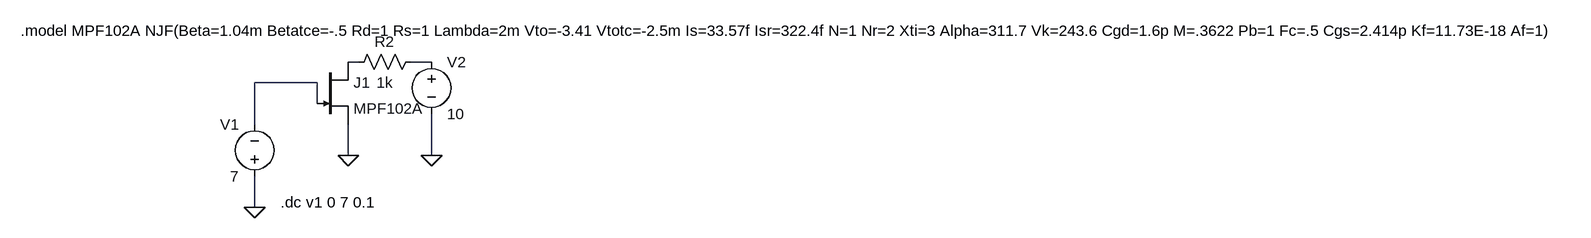
[diagram p0: schematic Sim-estrang.asc]
Sim-estrang.asc, the LTspice schematic file:
Version 4
SHEET 1 2304 680
WIRE 208 64 192 64
WIRE 320 64 288 64
WIRE 144 96 48 96
WIRE 144 128 144 96
WIRE 48 160 48 96
WIRE 192 208 192 160
WIRE 320 208 320 144
WIRE 48 288 48 240
FLAG 48 288 0
FLAG 192 208 0
FLAG 320 208 0
SYMBOL voltage 48 256 R180
WINDOW 0 24 96 Left 2
WINDOW 3 24 16 Left 2
SYMATTR InstName V1
SYMATTR Value 7
SYMBOL voltage 320 48 R0
SYMATTR InstName V2
SYMATTR Value 10
SYMBOL njf 144 64 R0
SYMATTR InstName J1
SYMATTR Value MPF102A
SYMBOL res 304 48 R90
WINDOW 0 0 56 VBottom 2
WINDOW 3 32 56 VTop 2
SYMATTR InstName R2
SYMATTR Value 1k
TEXT 88 280 Left 2 !.dc v1 0 7 0.1
TEXT -312 16 Left 2 !.model MPF102A NJF(Beta=1.04m Betatce=-.5 Rd=1 Rs=1 Lambda=2m Vto=-3.41 Vtotc=-2.5m Is=33.57f Isr=322.4f N=1 Nr=2 Xti=3 Alpha=311.7 Vk=243.6 Cgd=1.6p M=.3622 Pb=1 Fc=.5 Cgs=2.414p Kf=11.73E-18 Af=1)

The netlist it stands for:
* Sim-estrang.asc
V1 0 N003 7
V2 N002 0 10
J1 N001 N003 0 MPF102A
R2 N002 N001 1k
.model NJF NJF
.model PJF PJF
.lib standard.jft
.dc v1 0 7 0.1
.model MPF102A NJF(Beta=1.04m Betatce=-.5 Rd=1 Rs=1 Lambda=2m Vto=-3.41 Vtotc=-2.5m Is=33.57f Isr=322.4f N=1 Nr=2 Xti=3 Alpha=311.7 Vk=243.6 Cgd=1.6p M=.3622 Pb=1 Fc=.5 Cgs=2.414p Kf=11.73E-18 Af=1)
.backanno
.end